# Altium schematic sheet Power_input.SchDoc
size A4; DocumentNumber: 4; SheetNumber: 4; SheetTotal: 4
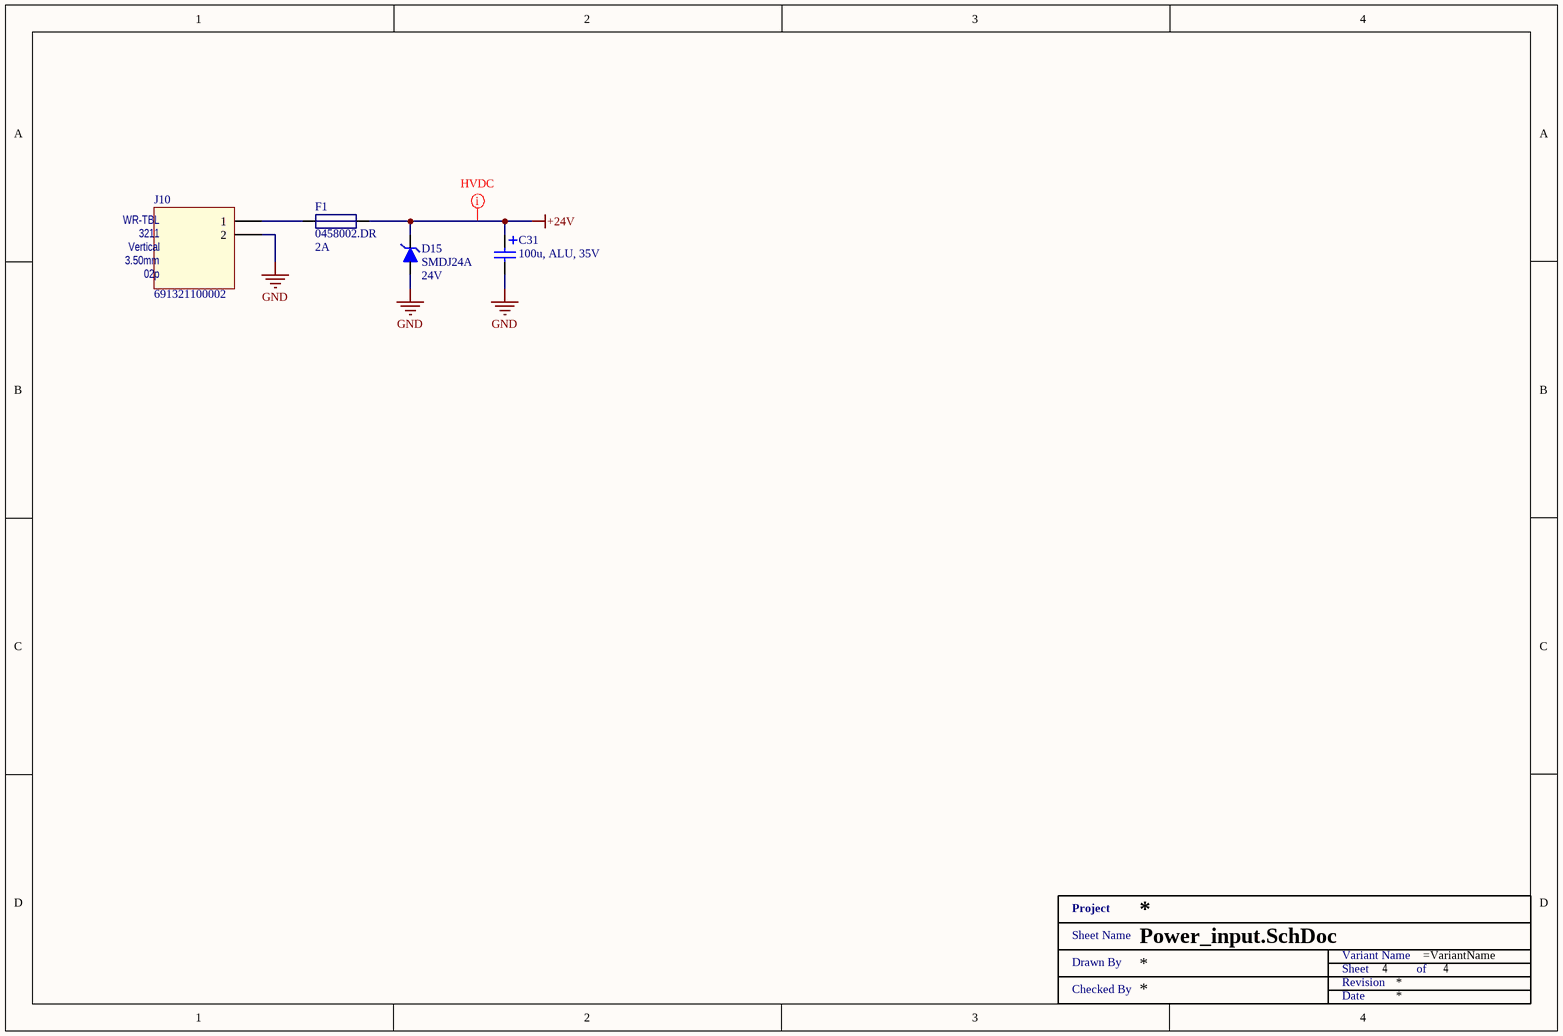
[diagram p0: Power_input.SchDoc]

## Parts
C31  100u, ALU, 35V  [WCAP-ATLI_6.3x11x2.5]
D15  SMDJ24A  Reverse Standoff Voltage: 24V  [DO-214AB]
F1  0458002.DR  Current Rating: 2A  [SMD1206 - FUSE]
J10  691321100002  [691321100002]
XX?  Title 1  (value not drawn)  (graphical)

## Nets
+24V: C31.1 D15.1 F1.2
GND: C31.2 D15.2 J10.2
NetF1_1: F1.1 J10.1

## Layout directives
net class HVDC: +24V

## Notes on the sheet
- (in symbol 691321100002) WR-TBL; 3211; 3.50mm; 02p
- (in symbol Title 1) Project; Sheet Name; Variant Name; Drawn By; Sheet; of; Revision; Checked By; Date

## Library data of the parts
C31 = 860010573007: WURTH ELEKTRONIK         860010573007             Electrolytic Capacitor, 100 F, 35 V, WCAP-ATG8 Series,  20%, Radial Leaded, 6.3 mm; Manufacturer: Wurth Electronics; Polarity: Polar; Ripple Current: 231mA; Life (Hours): 2000Hour; Capacitance: 100uF; Supplier 1: Mouser; Supplier Part Number 1: 710-860010573007; Manufacturer Part Number: 860010573007; RoHS: Yes; Category: Aluminum Electrolytic Capacitors; Stock 1: 1755; Pricing 1: 1=0.16000, 10=0.15100, 25=0.15100, 50=0.12700, 100=0.11100, 250=0.09800 (USD); Mount: Through Hole; Case/Package: Radial; Min Operating Temperature: -40°C; Max Operating Temperature: 85°C; Package Quantity: 1; Tolerance: 20%; Packaging: Tape and Reel; Voltage Rating: 35V; Voltage Rating (DC): 35V; Diameter: 6.3mm; Height: 11mm; Lead Pitch: 0.098inch; Height - Seated (Max): 0.492inch; REACH SVHC: Unknown; ComponentLink1URL: http://www.farnell.com/datasheets/1879547.pdf?src-supplier=Farnell; ComponentLink1Description: http://www.farnell.com/datasheets/1879547.pdf?src-supplier=Farnell; ComponentLink2URL: http://katalog.we-online.de/pbs/datasheet/860010573007.pdf?src-supplier=Digi-Key; ComponentLink2Description: http://katalog.we-online.de/pbs/datasheet/860010573007.pdf?src-supplier=Digi-Key; ComponentLink3URL: http://www.farnell.com/datasheets/1879547.pdf?src-supplier=Element14; ComponentLink3Description: http://www.farnell.com/datasheets/1879547.pdf?src-supplier=Element14; Supplier 2: Digi-Key; Supplier Part Number 2: 732-8737-1-ND
D15 = SMDJ24A: ESD Suppressors / TVS Diodes 5kW 24V 5% Uni-Directional; Manufacturer: Littelfuse; Manufacturer Part Number: 5.0SMDJ24A; Reverse Breakdown Voltage: 26.7V; Clamping Voltage: 38.9V; Polarity: Unidirectional; Number of Unidirectional Channels: 1; Power Line Protection: No; Peak Pulse Current: 129A; Test Current: 1mA; Leakage Current: 5uA; Diode Type: ZENER; Max Power Dissipation: 6.5W; Max Breakdown Voltage: 29.5V; Supplier 1: Mouser; Supplier Part Number 1: 576-5.0SMDJ24A; RoHS: Yes; Category: TVS Diodes; Stock 1: 2732; Pricing 1: 1=1.78000, 10=1.60000, 50=1.60000, 100=1.29000, 500=1.06000, 1000=0.87700, 3000=0.84900, 10000=0.84900 (USD); Mount: Surface Mount; Case/Package: DO-214AB; Number of Pins: 2; Min Operating Temperature: -65°C; Max Operating Temperature: 150°C; Package Quantity: 3000; Packaging: Tape and Reel; Peak Pulse Power: 5kW; Min Breakdown Voltage: 26.7V; Number of Elements: 1; Resistor Type: Zener; Series: 5.0SMDJ; Operating Supply Voltage: 24V; Max Surge Current: 129A; Breakdown Voltage: 26.7V; Number of Channels: 1; Termination: SMD/SMT; RoHS Compliant: Yes; REACH SVHC: No SVHC; Lead Free: Lead Free; ComponentLink1URL: https://datasheet.ciiva.com/332/littelfuse-tvs-diode-5-0smdj-datasheet-pdf-332921.pdf?src-supplier=Digi-Key; ComponentLink1Description: https://datasheet.ciiva.com/332/littelfuse-tvs-diode-5-0smdj-datasheet-pdf-332921.pdf?src-supplier=Digi-Key; ComponentLink2URL: https://datasheet.ciiva.com/332/littelfuse-tvs-diode-5-0smdj-datasheet-pdf-332922.pdf?src-supplier=Digi-Key; ComponentLink2Description: https://datasheet.ciiva.com/332/littelfuse-tvs-diode-5-0smdj-datasheet-pdf-332922.pdf?src-supplier=Digi-Key; ComponentLink3URL: https://datasheet.ciiva.com/332/littelfuse-tvs-diode-5-0smdj-datasheet-pdf-332920.pdf?src-supplier=Digi-Key; ComponentLink3Description: https://datasheet.ciiva.com/332/littelfuse-tvs-diode-5-0smdj-datasheet-pdf-332920.pdf?src-supplier=Digi-Key
F1 = 0458002.DR: FUSE BRD MNT 2A 48VAC 75VDC 1206; Manufacturer: Littelfuse; Body Material: Ceramic; Voltage Rating (AC): 48V; Voltage Rating (DC): 75V; Resistance: 69.5mR; DC Cold Resistance: 63.5mR; Fuse Type: Board Mount (Cartridge Style Excluded); Voltage Rating: 63V; Approvals: cULus; Supplier 1: Mouser; Supplier Part Number 1: 576-0458002.DR; Manufacturer Part Number: 0458002.DR; Stock 1: 11466; Pricing 1: 1 = 1.31000, 10 = 0.97500, 50 = 0.97500, 100 = 0.81200, 1000 = 0.67000, 10000 = 0.50800 (USD); RoHS: Yes; Mount: Surface Mount; Case/Package: 1206; Case Code (Metric): 3216; Case Code (Imperial): 1206; Housing Material: Ceramic; Min Operating Temperature: -55°C; Max Operating Temperature: 125°C; Packaging: Tape and Reel; Package Quantity: 1500; Fuse Current: 2A; Termination: SMD/SMT; Working Voltage: 63V; Length: 0.125inch; Height: 0.062inch; Width: 1.575mm; Depth: 1.58mm; REACH SVHC: No SVHC; Lead Free: Lead Free; ComponentLink1URL: https://datasheet.ciiva.com/1730/337915-1730544.pdf?src-supplier=Newark; ComponentLink1Description: https://datasheet.ciiva.com/1730/337915-1730544.pdf?src-supplier=Newark; ComponentLink2URL: https://datasheet.ciiva.com/299/littelfuse-fuse-458-series-299804.pdf?src-supplier=Digi-Key; ComponentLink2Description: https://datasheet.ciiva.com/299/littelfuse-fuse-458-series-299804.pdf?src-supplier=Digi-Key; ComponentLink3URL: https://datasheet.ciiva.com/299/littelfuse-fuse-458-series-299805.pdf?src-supplier=Digi-Key; ComponentLink3Description: https://datasheet.ciiva.com/299/littelfuse-fuse-458-series-299805.pdf?src-supplier=Digi-Key; ComponentLink4URL: https://datasheet.ciiva.com/299/littelfuse-fuse-458-series-299806.pdf?src-supplier=Digi-Key; ComponentLink4Description: https://datasheet.ciiva.com/299/littelfuse-fuse-458-series-299806.pdf?src-supplier=Digi-Key; Supplier 2: Farnell; Supplier Part Number 2: 1702533; Stock 2: 1620; Supplier 3: Digi-Key; Supplier Part Number 3: F2931CT-ND; Stock 3: 14221; Pricing 3: 1 = 1.43000, 5 = 1.38400, 10 = 1.29500, 50 = 1.07180, 100 = 0.89320, 250 = 0.87088, 500 = 0.73690 (USD)
J10 = 691321100002: WR-TBL Series 3211 - 3.50 mm Vertical PCB Header; Manufacturer: Wurth Electronics; Number of Positions Per Level: 2; Number of Levels: 1; Current: 10A; Voltage: 300V; Pitch: 0.138inch; Supplier: Mouser; Supplier Part Number: 710-691321100002; Manufacturer Part Number: 691321100002; RoHS: Yes; Category: Terminal Blocks; Stock: 2512; Pricing: 1=0.44, 10=0.394, 50=0.34, 100=0.305, 1000=0.269, 10000=0.268 (USD); Mounting Technology: Through Hole; Color: Green; Contact Material: Brass; Package Quantity: 1000; Packaging: Bulk; Number of Rows: 1; Termination: Solder; Number of Contacts: 2; Orientation: Vertical; Series: WR-TBL Series 3211; Voltage Rating: 300V; Length: 7mm; Width: 8.1mm; Height: 12.7mm; RoHS Compliant: Yes; Reach SVHC Compliant: Unknown; Lead Free: 5697LeadFree; ComponentLink1URL: https://datasheet.ciiva.com/8043/1442231-8043542.pdf?src-supplier=Element14; ComponentLink1Description: https://datasheet.ciiva.com/8043/1442231-8043542.pdf?src-supplier=Element14; ComponentLink2URL: https://datasheet.ciiva.com/795/6913211000xx-795780.pdf?src-supplier=Digikey; ComponentLink2Description: https://datasheet.ciiva.com/795/6913211000xx-795780.pdf?src-supplier=Digikey; ComponentLink3URL: https://datasheet.ciiva.com/48692/001088697-da-01-en-wr-tbl-terminal-block3211-691321100002-48692842.pdf?src-supplier=Conrad; ComponentLink3Description: https://datasheet.ciiva.com/48692/001088697-da-01-en-wr-tbl-terminal-block3211-691321100002-48692842.pdf?src-supplier=Conrad; Supplier 1: Mouser; Supplier Part Number 1: 710-691321100002; Supplier 2: Farnell; Supplier Part Number 2: 1841308; Supplier 3: Digikey; Supplier Part Number 3: 732-2763-ND